# EAGLE design Moteino (EAGLE 7.3.0)
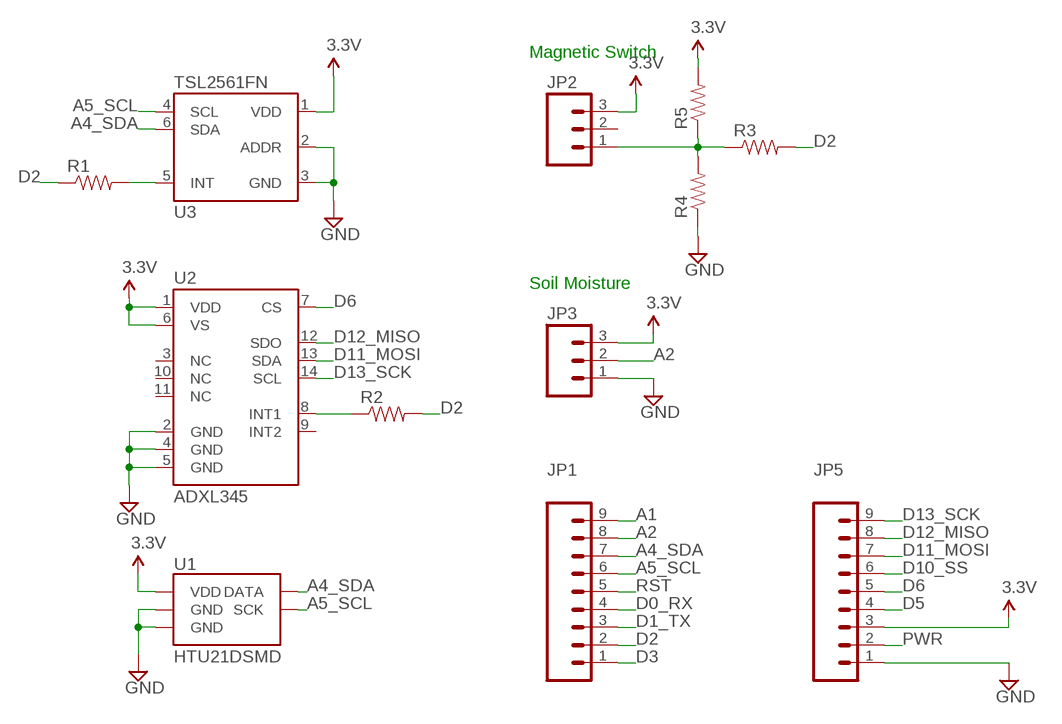
[diagram p0: schematic, sheet 1]

## Parts
JP1  M09  [1X09]
JP2  M03PTH  [1X03]
JP3  M03PTH  [1X03]
JP5  M09  [1X09]
R1  RESISTOR0603-RES  [0603-RES]
R2  RESISTOR0603-RES  [0603-RES]
R3  RESISTOR0603-RES  [0603-RES]
R4  RESISTOR0603-RES  [0603-RES]
R5  RESISTOR0603-RES  [0603-RES]
U1  HTU21DSMD  [HTU21D]
U2  ADXL345  [LGA14]
U3  TSL2561FN  [FN-6]

## Nets
A1: JP1.9
A2: JP1.8 JP3.2
A4_SDA: JP1.7 U1.DATA U3.6(SDA)
A5_SCL: JP1.6 U1.SCK U3.4(SCL)
D0_RX: JP1.4
D1_TX: JP1.3
D2: JP1.2 R1.1 R2.2 R3.2
D3: JP1.1
D5: JP5.4
D6: JP5.5 U2.7(CS)
D10_SS: JP5.6
D11_MOSI: JP5.7 U2.13(SDA)
D12_MISO: JP5.8 U2.12(SDO)
D13_SCK: JP5.9 U2.14(SCL)
GND [power]: JP3.1 JP5.1 R4.1 U1.7(GND) U1.GND U2.2(GND) U2.4(GND) U2.5(GND) U3.2(ADDR) U3.3(GND)
N$2: JP2.1 R3.1 R4.2 R5.1
N$3: R1.2 U3.5(INT)
N$7: R2.1 U2.8(INT1)
PWR [power]: JP5.2
RST: JP1.5
VCC: JP2.3 JP3.3 JP5.3 R5.2 U1.VDD U2.1(VDD) U2.6(VS) U3.1(VDD) ; supply symbol labelled 3.3V
Unconnected: JP2.2 U2.3(NC) U2.9(INT2) U2.10(NC) U2.11(NC)

## Notes on the sheet
- Magnetic Switch
- Soil Moisture

## Library data of the parts
JP1 JP5 = SparkFun-Connectors:M09: Header 9 Standard 9-pin 0.1" header. Use with straight break away headers (SKU : PRT-00116), right angle break away headers (PRT-00553), swiss pins (PRT-00743), machine pins (PRT-00117), and female headers (PRT-00115).
JP2 JP3 = SparkFun-Connectors:M03: Header 3 Standard 3-pin 0.1" header. Use with straight break away headers (SKU : PRT-00116), right angle break away headers (PRT-00553), swiss pins (PRT-00743), machine pins (PRT-00117), and female headers (PRT-00115). Molex polarized connector foot print use with SKU : PRT-08232 with associated crimp pins and housings.
R1-R5 = SparkFun-Passives:RESISTOR: Resistor Basic schematic elements and footprints for 0603, 1206, and PTH resistors.
U1 = SparkFun-Sensors:HTU21D; PROD_ID: IC-11793
U2 = SparkFun-Sensors:ADXL345: 3-axis SPI/I2C 2/4/8/16g accelerometer
U3 = SparkFun-Sensors:TSL2561: TSL2561 illumination sensor Approximates Human Eye Response Precisely Measures Illuminance Programmable Interrupt Function with User-Defined Upper and Lower Threshold 400 KHz I2C interface Programmable Analog Gain and Integration Time Supporting 1,000,000-to-1 Dynamic Range Automatically Rejects 50/60-Hz Lighting Ripple Low Active Power (0.75 mW Typical) with Power Down Mode RoHS Compliant The TSL2561 is a light-to-digital converter that transform light intensity to a digital signal output via I2C interface. The device combines one broadband photodiode (visible plus infrared) and one infrared-responding photodiode on a single CMOS integrated circuit capable of providing a near-photopic response over an effective 20-bit dynamic range (16-bit resolution). Two integrating ADCs convert the photodiode currents to a digital output that represents the irradiance measured on each channel. This digital output can be input to a microprocessor where illuminance (ambient light level) in lux is derived using an empirical formula to approximate the human eye response. The TSL2561 device supports a traditional level style interrupt that remains asserted until the firmware clears it.

## Board
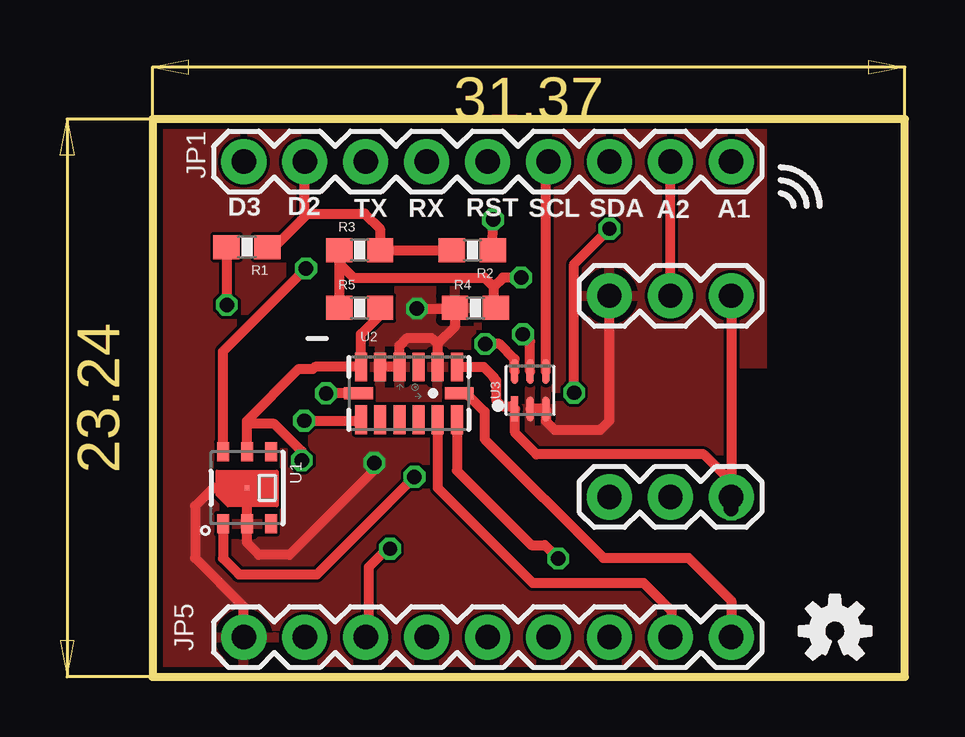
[diagram p1: board, top side]
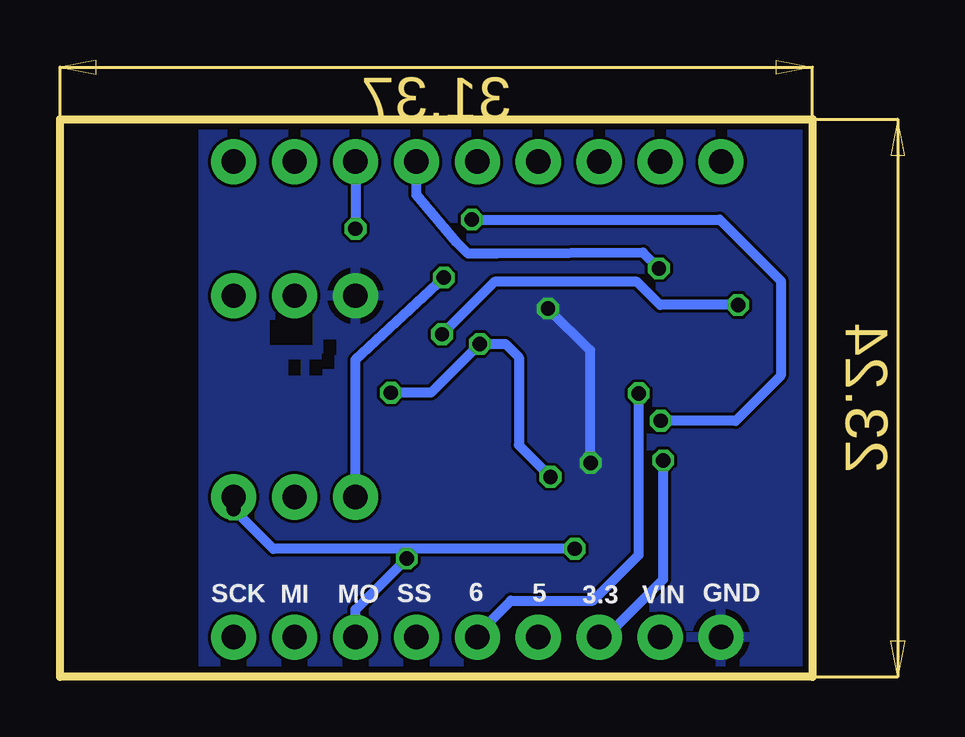
[diagram p2: board, bottom side, seen from below]

Size 31.37 x 23.24 mm. Coordinates in mm from the lower left corner, seen from the top.
Outline: 0,0 31.37,0 31.37,23.24 0,23.24 0,0
Copper layers (1*16): Top 0.035mm / dielectric 1.5mm / Bottom 0.035mm
Design rules "dirt_cheap_dirty_boards.v1": minimum track width 5mil, minimum drill 12mil, track to track 5mil, track to pad 5mil, pad to pad 5mil, via to via 5mil, smd to smd 0mil, copper to edge 10mil, drill to drill 10mil, minimum pad ring 10mil, minimum via ring 6mil, stop-mask expansion 2mil, vias tented up to drill 25mil, thermal gap 10mil
tRestrict: area 24,8.9 to 28.8,12.8; area 5.6,16.9 to 6.6,18.5; area 5,9.7 to 6.5,10.4
bRestrict: area 27.2,17.7 to 29,18.7; area 20.8,13.8 to 22.6,14.9; area 21.3,12.6 to 21.8,13.2; area 20.4,12.6 to 21,13.2; area 19.9,12.8 to 20.4,13.5; area 19.9,13.4 to 20.4,14; area 26.3,18.9 to 26.8,19.5; area 26.3,17.9 to 26.8,18.5; area 27.3,19.1 to 27.8,19.8; area 27.7,18.8 to 28.8,19.6

### Footprints (pad centres in the part's own frame; a part is rotated, then mirrored left to right if it is on the bottom)
1X09 = drill 1.016 pad 1.88: 1 0,0; 2 2.54,0; 3 5.08,0; 4 7.62,0; 5 10.16,0; 6 12.7,0; 7 15.24,0; 8 17.78,0; 9 20.32,0
1X03 = drill 1.016 pad 1.88: 1 0,0; 2 2.54,0; 3 5.08,0
0603-RES = smd 1.1 x 1: 1 -0.85,0; 2 0.85,0
HTU21D = smd 0.2 x 0.2: 7 0,0 | smd 0.8 x 0.5: DATA 1.5,-1; GND 1.5,0; NC@1 -1.5,1; NC@6 1.5,1; SCK -1.5,-1; VDD -1.5,0
LGA14 = smd 0.5 x 1.2: 1 2,1.1; 2 1.2,1.1; 3 0.4,1.1; 4 -0.4,1.1; 5 -1.2,1.1; 6 -2,1.1; 8 -2,-1.1; 9 -1.2,-1.1; 10 -0.4,-1.1; 11 0.4,-1.1; 12 1.2,-1.1; 13 2,-1.1 | smd 1.2 x 0.5: 7 -2.1,0; 14 2.1,0
FN-6 = smd 1.05 x 0.3: 1 -0.775,0.65; 2 -0.775,0; 3 -0.775,-0.65; 4 0.775,-0.65; 5 0.775,0; 6 0.775,0.65

### Placement (x,y rotation side)
JP1  3.81,21.46 0 top
JP2  19.05,7.49 0 top
JP3  19.05,15.88 0 top
JP5  3.81,1.65 0 top
R1  3.94,17.91 180 top
R2  13.34,17.78 180 top
R3  8.64,17.78 0 top
R4  13.46,15.37 0 top
R5  8.64,15.37 0 top
U1  3.94,7.87 270 top
U2  10.69,11.81 0 top
U3  15.75,11.94 90 top
U$3  [OSHW-LOGO-S]  28.45,1.91 0 top

### Tracks (layer width: path | path; a pad name or v marks a point on that pad's centre or on a via)
A2
  Top 0.406: JP3.2 JP1.8
A4_SDA  (via drill 0.6)
  Top 0.406: U1.DATA 2.94,4.94 3.61,4.27 6.86,4.27 v10.92,8.33 | U3.6 15.1,13.23 14.46,13.87 v13.87,13.87 | v17.58,11.84 17.58,17.2 v19.05,18.67
  Bottom 0.406: JP1.7 v19.05,18.67 | v17.58,11.84 15.9,11.84 v13.87,13.87 12.8,13.87 12.24,13.31 12.24,9.65 v10.92,8.33
A5_SCL  (via drill 0.6)
  Top 0.406: U1.SCK 2.94,13.55 v6.4,17.02 | U3.4 16.4,21.35 JP1.6
  Bottom 0.406: v6.4,17.02 7.06,17.68 13.16,17.63 14.36,17.63 14.82,18.09 16.51,20.09 JP1.6
D2
  Top 0.406: 6.35,19.3 JP1.2 | R1.1 5.08,17.91 6.35,19.18 6.35,19.3 | 6.35,19.3 8.85,19.3 9.49,18.67 R3.2 R2.2
D6  (via drill 0.6)
  Top 0.406: U2.7 v7.24,11.81
  Bottom 0.406: 7.26,11.79 v7.24,11.81 7.24,5.08 9.14,3.17 12.57,3.17 13.97,1.78 JP5.5
D11_MOSI  (via drill 0.6)
  Top 0.406: v16.92,4.93 16.36,5.49 15.8,5.49 12.69,8.59 U2.13
  Bottom 0.406: JP5.7 19.05,2.79 v16.92,4.93
D12_MISO
  Top 0.406: JP5.8 21.64,1.7 21.64,2.74 20.47,3.91 15.85,3.91 11.89,7.87 U2.12
D13_SCK
  Top 0.406: U2.14 13.08,11.81 13.84,11.05 13.84,9.91 18.8,4.95 22.35,4.95 24.13,3.17 JP5.9
GND  (via drill 0.6)
  Top 0.406: U2.5 U2.4 10.29,13.8 10.62,14.12 11.63,14.12 11.89,13.87 | JP5.1 3.81,2.92 1.78,4.95 1.78,7.11 2.54,7.87 U1.7 U1.GND 3.94,5.59 4.45,5.08 5.71,5.08 9.25,8.61 v9.25,8.91 | v11.02,15.34 12.79,15.34 R4.1 12.61,14.59 11.89,13.87 | U3.2 U3.3 16.4,10.65 16.76,10.29 18.67,10.29 19.05,10.67 JP3.1 | 11.89,13.87 U2.2
  Bottom 0.406: v11.02,15.34 9.27,13.61 9.27,8.94 v9.25,8.91
  pour Bottom: 23.49,19.94 23.37,19.94 23.37,20.07
  pour Top: -0.25,23.5 24.76,23.5 arc-90 25.4,22.86 25.4,-0.13 0.38,-0.13 arc-90 -0.25,0.51 -0.25,23.37
  pour Bottom: 0.76,23.62 24.76,23.62 arc-90 25.4,22.99 25.4,-0.13 0.38,-0.13 arc-90 -0.25,0.51 -0.25,23.5 0.76,23.5
N$2  (via drill 0.6)
  Top 0.406: R5.1 R3.1 7.79,17.23 8.38,16.64 13.84,16.64 14.22,16.26 | 14.22,16.26 14.22,15.46 R4.2 | v15.37,16.64 14.61,16.64 14.22,16.26
  Bottom 0.406: JP2.1 19.05,13.21 v15.37,16.64
N$3  (via drill 0.6)
  Top 0.406: R1.2 3.09,15.51 v3.1,15.49 | U3.5 15.75,13.97 v15.44,14.28
  Bottom 0.406: v3.1,15.49 6.35,15.49 7.31,16.46 13.26,16.46 v15.44,14.28
N$7  (via drill 0.6)
  Top 0.406: R2.1 v14.2,19.05 | v6.32,10.67 8.65,10.67 U2.8
  Bottom 0.406: v14.2,19.05 3.86,19.05 1.32,16.51 1.32,12.55 3.2,10.67 v6.32,10.67
VCC  (via drill 0.6)
  Top 0.406: U1.VDD 3.94,10.54 | U2.1 13.81,12.91 14.22,12.5 14.22,12.45 14.33,12.34 14.33,11.53 14.58,11.28 14.98,11.28 U3.1 15.11,11.15 15.11,10.16 16,9.27 22.99,9.27 24.13,8.13 | U2.6 | U2.6 6.77,12.91 6.69,12.83 6.1,12.83 3.94,10.67 3.94,10.54 | R5.2 9.4,15.28 9.4,14.99 8.69,14.28 U2.6 | v24.13,6.99 JP2.3 | v6.22,9.02 6.22,9.4 5.08,10.54 3.94,10.54 | JP3.3 24.13,8.13 | 24.13,8.13 JP2.3 | v9.91,5.33 9.78,5.33 9.02,4.57 9.02,1.78 JP5.3 | JP2.3 24.13,7.62
  Bottom 0.406: JP5.3 8.64,1.91 8.38,1.91 6.22,4.06 v6.22,9.02 | v9.91,5.33 22.48,5.33 v24.13,6.99

### Text on the board
bPlace: GND | VIN | 3.3 | 5 | 6 | SS | MO | MI | SCK
tDocu: REG
_tsilk: D3 | D2 | TX | RX | A2 | A1 | RST | SCL | SDA